# Altium schematic sheet Power.SchDoc
size Letter
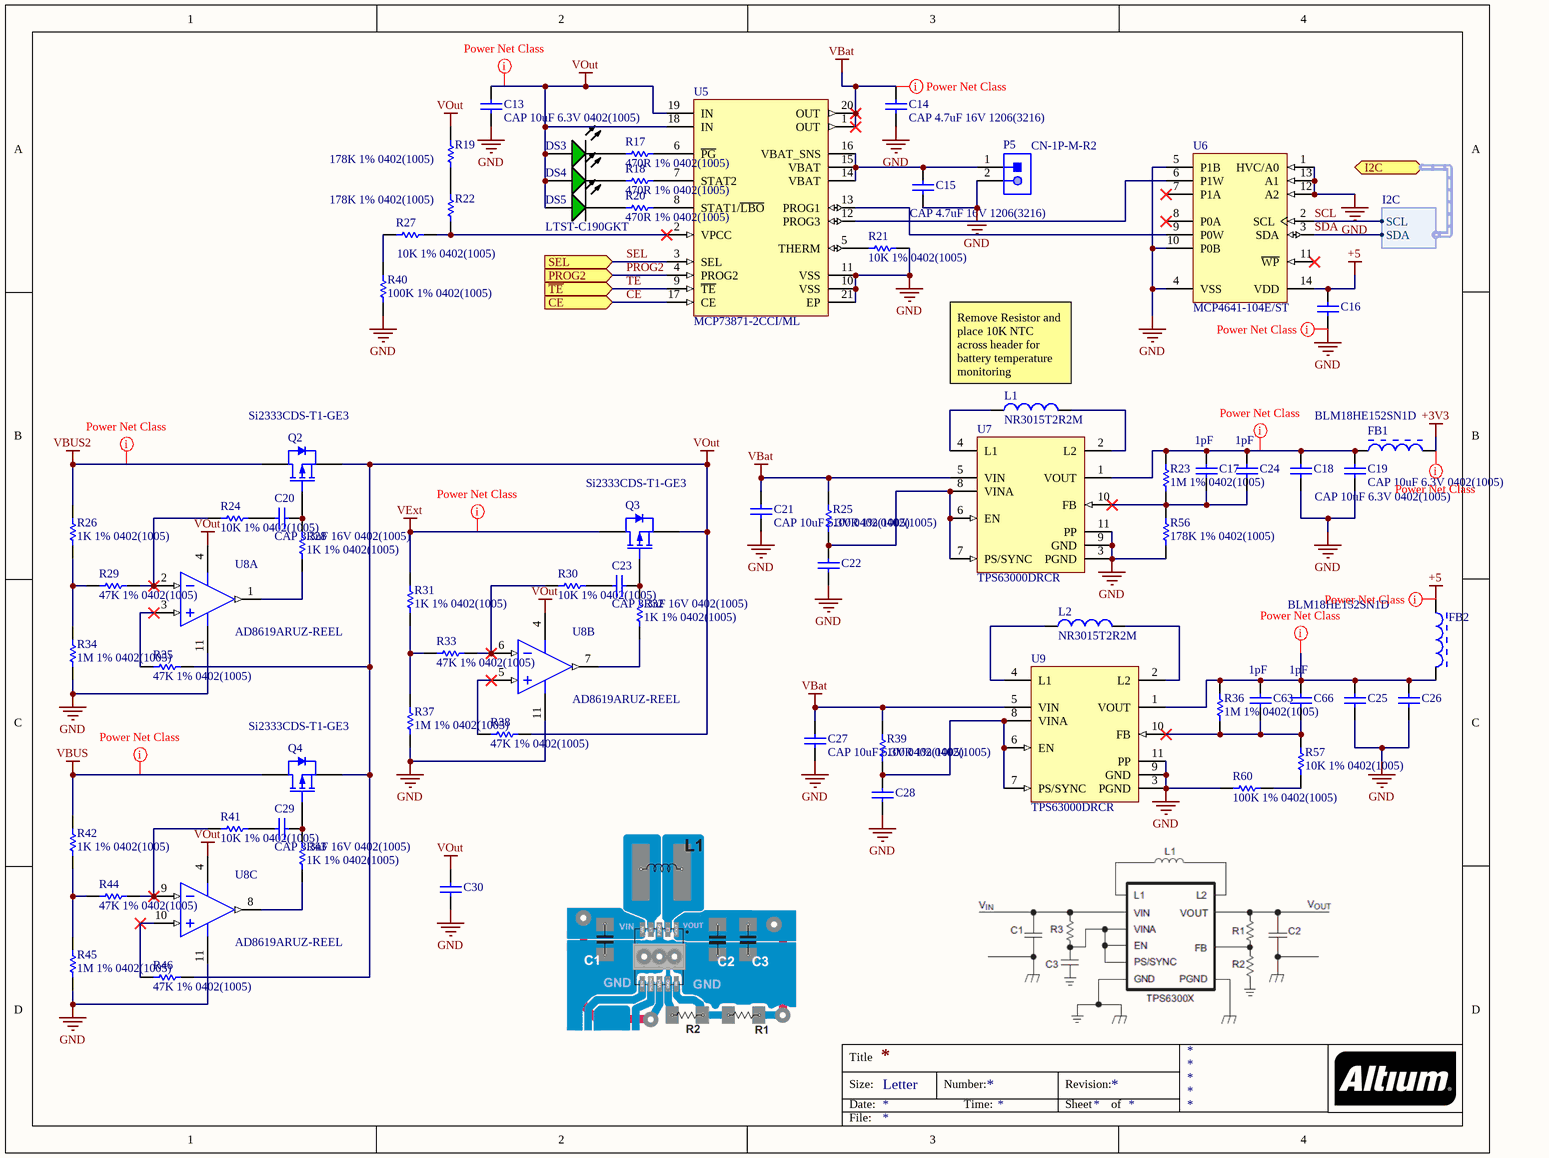
[diagram p0: Power.SchDoc]

## Parts
(Parts that share a designator on the sheet are numbered #1, #2 ... from top to bottom, then left to right.)
C13  CAP 10uF 6.3V 0402(1005)  [CAPC0402(1005)60_L]
C14  CAP 4.7uF 16V 1206(3216)  [CAPC1206(3216)190_N]
C15  CAP 4.7uF 16V 1206(3216)  [CAPC1206(3216)190_N]
C16  CAP 100nF 10V 0402(1005)  [CAPC0402(1005)60_L]  (value not drawn)
C17  value 1pF  [CAPC0402(1005)33_L]  (hidden comment: CAP 1pF 50V 0402(1005))
C18  CAP 10uF 6.3V 0402(1005)  [CAPC0402(1005)60_L]
C19  CAP 10uF 6.3V 0402(1005)  [CAPC0402(1005)60_L]
C20  CAP 3.3nF 16V 0402(1005)  [CAPC0402(1005)60_L]
C21  CAP 10uF 6.3V 0402(1005)  [CAPC0402(1005)60_L]
C22  CAP 100nF 10V 0402(1005)  [CAPC0402(1005)60_L]  (value not drawn)
C23  CAP 3.3nF 16V 0402(1005)  [CAPC0402(1005)60_L]
C24  value 1pF  [CAPC0402(1005)33_L]  (hidden comment: CAP 1pF 50V 0402(1005))
C25  CAP 10uF 6.3V 0402(1005)  [CAPC0402(1005)60_L]  (value not drawn)
C26  CAP 10uF 6.3V 0402(1005)  [CAPC0402(1005)60_L]  (value not drawn)
C27  CAP 10uF 6.3V 0402(1005)  [CAPC0402(1005)60_L]
C28  CAP 100nF 10V 0402(1005)  [CAPC0402(1005)60_L]  (value not drawn)
C29  CAP 3.3nF 16V 0402(1005)  [CAPC0402(1005)60_L]
C30  CAP 100nF 10V 0402(1005)  [CAPC0402(1005)60_L]  (value not drawn)
C63  value 1pF  [CAPC0402(1005)33_L]  (hidden comment: CAP 1pF 50V 0402(1005))
C66  value 1pF  [CAPC0402(1005)33_L]  (hidden comment: CAP 1pF 50V 0402(1005))
DS3  LTST-C190GKT  [LTST-C190GKT_V]  (value not drawn)
DS4  LTST-C190GKT  [LTST-C190GKT_V]  (value not drawn)
DS5  LTST-C190GKT  [LTST-C190GKT_V]
FB1  BLM18HE152SN1D  [MURA-BLM18-RF-H4-CHIP-2_V]
FB2  BLM18HE152SN1D  [MURA-BLM18-RF-H4-CHIP-2_V]
L1  NR3015T2R2M  [TAYO-IND0315_V]
L2  NR3015T2R2M  [TAYO-IND0315_V]
P5  CN-1P-M-R2  [B2B-PH-K-S]
Q2  Si2333CDS-T1-GE3  [DIOD-SOT23-3_V]
Q3  Si2333CDS-T1-GE3  [DIOD-SOT23-3_V]
Q4  Si2333CDS-T1-GE3  [DIOD-SOT23-3_V]
R17  470R 1% 0402(1005)  [RESC0402(1005)_L]
R18  470R 1% 0402(1005)  [RESC0402(1005)_L]
R19  178K 1% 0402(1005)  [RESC0402(1005)_L]
R20  470R 1% 0402(1005)  [RESC0402(1005)_L]
R21  10K 1% 0402(1005)  [RESC0402(1005)_L]
R22  178K 1% 0402(1005)  [RESC0402(1005)_L]
R23  1M 1% 0402(1005)  [RESC0402(1005)_L]
R24  10K 1% 0402(1005)  [RESC0402(1005)_L]
R25  100R 1% 0402(1005)  [RESC0402(1005)_L]
R26  1K 1% 0402(1005)  [RESC0402(1005)_L]
R27  10K 1% 0402(1005)  [RESC0402(1005)_L]
R28  1K 1% 0402(1005)  [RESC0402(1005)_L]
R29  47K 1% 0402(1005)  [RESC0402(1005)_L]
R30  10K 1% 0402(1005)  [RESC0402(1005)_L]
R31  1K 1% 0402(1005)  [RESC0402(1005)_L]
R32  1K 1% 0402(1005)  [RESC0402(1005)_L]
R33  47K 1% 0402(1005)  [RESC0402(1005)_L]
R34  1M 1% 0402(1005)  [RESC0402(1005)_L]
R35  47K 1% 0402(1005)  [RESC0402(1005)_L]
R36  1M 1% 0402(1005)  [RESC0402(1005)_L]
R37  1M 1% 0402(1005)  [RESC0402(1005)_L]
R38  47K 1% 0402(1005)  [RESC0402(1005)_L]
R39  100R 1% 0402(1005)  [RESC0402(1005)_L]
R40  100K 1% 0402(1005)  [RESC0402(1005)_L]
R41  10K 1% 0402(1005)  [RESC0402(1005)_L]
R42  1K 1% 0402(1005)  [RESC0402(1005)_L]
R43  1K 1% 0402(1005)  [RESC0402(1005)_L]
R44  47K 1% 0402(1005)  [RESC0402(1005)_L]
R45  1M 1% 0402(1005)  [RESC0402(1005)_L]
R46  47K 1% 0402(1005)  [RESC0402(1005)_L]
R56  178K 1% 0402(1005)  [RESC0402(1005)_L]
R57  10K 1% 0402(1005)  [RESC0402(1005)_L]
R60  100K 1% 0402(1005)  [RESC0402(1005)_L]
U5  MCP73871-2CCI/ML  [QFN-ML20_M]
U6  MCP4641-104E/ST  [TSSOP-ST14_L]
U7  TPS63000DRCR  [DRC0010J_V]
U8#1  AD8619ARUZ-REEL  [ADI-RU-14_N]  (part A of 4)
U8#2  AD8619ARUZ-REEL  [ADI-RU-14_N]  (parts B,C of 4)
U9  TPS63000DRCR  [DRC0010J_V]

## Ports
CE (in), I2C (harness I2C), PROG2 (in), SEL (in), ~{TE} (in)

## Harnesses
I2C: SCL, SDA

## Nets
+3V3: FB1.2
+5: C16.2 FB2.1 U6.14(VDD)
GND: C13.1 C14.2 C15.1 C16.1 C18.1 C19.1 C21.1 C22.1 C25.1 C26.1 C27.1 C28.1 C30.1 P5.2 R21.2 R34.1 R37.1 R40.2 R45.1 R56.1 R60.1 U5.10(VSS) U5.11(VSS) U5.21(EP) U6.1(HVC/A0) U6.4(VSS) U6.5(P1B) U6.10(P0B) U6.12(A2) U6.13(A1) U7.3(PGND) U7.9(GND) U7.11(PP) U8#1.11(-V) U8#2.11(-V) U9.3(PGND) U9.9(GND) U9.11(PP)
VBat: C14.1 C21.2 C27.2 R25.2 R39.2 U5.1(OUT) U5.20(OUT) U7.5(VIN) U9.5(VIN)
VBUS: Q4.3(D) R42.2
VBUS2: Q2.3(D) R26.2
VExt: Q3.3(D) R31.2
VOut: C13.2 C30.2 DS3.1(A) DS4.1(A) DS5.1(A) Q2.2(S) Q3.2(S) Q4.2(S) R19.1 R35.2 R38.2 R46.2 U5.18(IN) U5.19(IN) U8#1.4(+V) U8#2.4(+V)
CE: U5.17(CE) ; port CE
PROG2: U5.4(PROG2) ; port PROG2
SCL: U6.2(SCL) ; port I2C.SCL
SDA: U6.3(SDA) ; port I2C.SDA
SEL: U5.3(SEL) ; port SEL
~{TE}: U5.9(~{TE}) ; port ~{TE}
NetC15_2: C15.2 P5.1 U5.14(VBAT) U5.15(VBAT) U5.16(VBAT_SNS)
NetC17_1: C17.1 C24.1 R23.1 R56.2 U7.10(FB)
NetC17_2: C17.2 C18.2 C19.2 C24.2 FB1.1 R23.2 U7.1(VOUT)
NetC20_1: C20.1 Q2.1(G) R28.2
NetC20_2: C20.2 R24.2
NetC22_2: C22.2 R25.1 U7.6(EN) U7.7(PS/SYNC) U7.8(VINA)
NetC23_1: C23.1 Q3.1(G) R32.2
NetC23_2: C23.2 R30.2
NetC25_2: C25.2 C26.2 C63.2 C66.2 FB2.2 R36.2 U9.1(VOUT)
NetC28_2: C28.2 R39.1 U9.6(EN) U9.7(PS/SYNC) U9.8(VINA)
NetC29_1: C29.1 Q4.1(G) R43.2
NetC29_2: C29.2 R41.2
NetC63_1: C63.1 C66.1 R36.1 R57.2 U9.10(FB)
NetDS3_2: DS3.2(K) R17.1
NetDS4_2: DS4.2(K) R18.1
NetDS5_2: DS5.2(K) R20.1
NetL1_1: L1.1 U7.4(L1)
NetL1_2: L1.2 U7.2(L2)
NetL2_1: L2.1 U9.4(L1)
NetL2_2: L2.2 U9.2(L2)
NetR17_2: R17.2 U5.6(~{PG})
NetR18_2: R18.2 U5.7(STAT2)
NetR19_2: R19.2 R22.1
NetR20_2: R20.2 U5.8(STAT1/~{LBO})
NetR21_1: R21.1 U5.5(THERM)
NetR22_2: R22.2 R27.2 U5.2(VPCC)
NetR24_1: R24.1 R29.2 U8#1.2(-IN_A)
NetR26_1: R26.1 R29.1 R34.2
NetR27_1: R27.1 R40.1
NetR28_1: R28.1 U8#1.1(OUT_A)
NetR30_1: R30.1 R33.2 U8#2.6(-IN_B)
NetR31_1: R31.1 R33.1 R37.2
NetR32_1: R32.1 U8#2.7(OUT_B)
NetR35_1: R35.1 U8#1.3(+IN_A)
NetR38_1: R38.1 U8#2.5(+IN_B)
NetR41_1: R41.1 R44.2 U8#2.9(-IN_C)
NetR42_1: R42.1 R44.1 R45.2
NetR43_1: R43.1 U8#2.8(OUT_C)
NetR46_1: R46.1 U8#2.10(+IN_C)
NetR57_1: R57.1 R60.2
NetU5_12: U5.12(PROG3) U6.6(P1W)
NetU5_13: U5.13(PROG1) U6.9(P0W)

Not connected (* = marked no-connect by the designer): U6 7(P1A)* 8(P0A)* 11(~{WP})*

## Layout directives
net class PowerNets: +3V3, +5, GND, NetC17_2, NetC25_2, VBat, VBUS, VBUS2, VExt, VOut

## Notes on the sheet
- (near L1) Remove Resistor and place 10K NTC across header for battery temperature monitoring
- Title
- Size:
- Date:
- Letter
- Number:
- Time:
- Revision:
- Sheet
- of
- File:

## Library data of the parts
C13 = CMP-1034-02138-1: CAP 10uF 6.3V ±20% 0402 (1005 Metric) Thickness 0.6mm SMD; Case-Metric: 1005; Tolerance: Â±20%; Case-EIA: 0402; Rated Voltage: 6.3 V; Value: 10uF; Technology: SMT; Max Thickness: 0.6 mm
C14 C15 = CMP-1037-04912-1: CAP 4.7uF 16V ±20% 1206 (3216 Metric) Thickness 1.9mm SMD; Tolerance: Â±20%; Case-EIA: 1206; Case-Metric: 3216; Max Thickness: 1.9 mm; Technology: SMT; Rated Voltage: 16 V; Value: 4.7uF
C16 C22 C28 C30 = CMP-1034-02066-1: CAP 100nF 10V ±20% 0402 (1005 Metric) Thickness 0.6mm SMD; Tolerance: Â±20%; Case-Metric: 1005; Case-EIA: 0402; Max Thickness: 0.6 mm; Rated Voltage: 10 V; Technology: SMT; Value: 100nF
C17 C24 C63 C66 = CMP-1034-00058-1: CAP 1pF 50V ±0.25pF 0402 (1005 Metric) Thickness 0.33mm SMD; Case-Metric: 1005; Case-EIA: 0402; Tolerance: Â±0.25pF; Technology: SMT; Max Thickness: 0.33 mm; Rated Voltage: 50 V
C18 C19 C21 C25-C27 = CMP-1034-02138-1: CAP 10uF 6.3V ±20% 0402 (1005 Metric) Thickness 0.6mm SMD; Tolerance: Â±20%; Case-EIA: 0402; Case-Metric: 1005; Max Thickness: 0.6 mm; Rated Voltage: 6.3 V; Technology: SMT; Value: 10uF
C20 C23 C29 = CMP-1034-01771-1: CAP 3.3nF 16V ±5% 0402 (1005 Metric) Thickness 0.6mm SMD; Case-EIA: 0402; Case-Metric: 1005; Tolerance: Â±5%; Value: 3.3nF; Technology: SMT; Rated Voltage: 16 V; Max Thickness: 0.6 mm
DS3-DS5 = CMP-1674-00007-1: LED Uni-Color Green, 100 mW, 5 V, -55 to 85 degC, 2-Pin SMD, RoHS, Tape and Reel; ComponentLink2Description: Datasheet; ComponentLink2URL: http://datasheet.octopart.com/LTST-C190GKT-Lite-On-datasheet-158530.pdf; ComponentLink1Description: Manufacturer URL; PackageReference: C190GKT; PackageDescription: 2-Pin Surface Mount Device, Body 1.6 x 0.8 mm; ComponentLink1URL: http://www.us.liteon.com/; DatasheetVersion: Dec-06
FB1 FB2 = CMP-0686-00368-2: Chip Ferrite Bead for GHz Band High-speed Signal Lines, 1500 Ohm, 500 mA, -55 to 125 degC, 1.6 x 0.8 x 0.95 mm SMD, Tape and Reel; Manufacturer: Murata; Rated Current: 500 mA; Impedance (at 100 MHz): 1500 Ohm +/- 25%; DC Resistance: 0.50 Ohm Max.; Packing: Tape and Reel; DatasheetVersion: 08/2013; ComponentLink1URL: http://www.murata.com/; Mounting Technology: Surface Mount; ComponentLink2URL: http://www.murata.com/products/catalog/pdf/c31e.pdf; ComponentLink3Description: Package Specification; ComponentLink2Description: Datasheet; PackageReference: BLM18_H950-2; ComponentLink1Description: Manufacturer URL; PackageDescription: 2-Pin Chip, Body 1.6 x 0.8 mm; ComponentLink3URL: http://www.murata.com/products/catalog/pdf/c31e.pdf; PartNumber: BLM18HE152SN1D; Operating Temperature Range: -55 to 125 degC
L1 L2 = CMP-0569-00001-2: SMD Power Inductor, 2.2 uH, +/- 20%, 3 x 3 x 1.5 mm, -25 to 120 degC, Pb-Free, Tape and Reel; Manufacturer: Taiyo Yuden; Inductance: 2.2 uH (+/-20%); Rated Current-Temperature Rise Current: 1500 mA; DC Resistance (max): 0.072 Ohm; Rated Current-Saturation Current: 1480 mA; Inductance Measuring Frequency: 100 kHz; Self-Resonant Frequency (min): 64 MHz; Avg. of DC. Resistance: 0.06 Ohm; Soldering Method: Reflow; Temperature Range: -25 to 120 degC; ComponentLink1Description: Manufacturer URL; Mounting Technology: Surface Mount; Halogen Free: TRUE; ComponentLink1URL: www.yuden.co.jp; Packing: Tape and Reel; DatasheetVersion: 1/11/2013; PackageDescription: 2-Pin SMT Inductor, Body 3 x 3 mm; ComponentLink2URL: http://www.yuden.co.jp/ut/product/category/inductor/NR3015T2R2M.pdf; PartNumber: NR3015T2R2M; RoHS Compliance: TRUE; PackageReference: IND3015; ComponentLink2Description: Datasheet; Case Size: 3015
Q2-Q4 = CMP-00020-0000-A.2: MOSFET 12V 5.1A 2.5W 35 mohms @ 4.5V; Manufacturer: Vishay; Channel Mode: Enhancement; Brand: Vishay Semiconductors; Rise Time: 35 ns; Transistor Polarity: P-Channel; Vgs - Gate-Source Voltage: 8 V; Number of Channels: 1 Channel; Pd - Power Dissipation: 1.25 W; Configuration: Single; Typical Turn-Off Delay Time: 45 ns; Transistor Type: 1 P-Channel; Vds - Drain-Source Breakdown Voltage: - 12 V; Typical Turn-On Delay Time: 13 ns; Tradename: TrenchFET; Standard Pack Qty: 3000; Reeling: True; Supplier Part Number: 781-SI2333CDS-T1-GE3; Series: SI2; Length: 3.04 mm; ComponentLink1URL: http://www.mouser.com/ds/2/427/si2333cd-244460.pdf; RoHS - Mouser: Y; Technology: Si; Width: 1.4 mm; Maximum Operating Temperature: + 150 C; Rds On - Drain-Source Resistance: 35 mOhms; Product: MOSFET Small Signal; Manufacturer Part Number: Si2333CDS-T1-GE3; Minimum Operating Temperature: - 55 C; Minimum Order Quantity: 1; Height: 1.02 mm; Supplier: Mouser; ComponentLink1Description: si2333cd-244460.pdf; Id - Continuous Drain Current: 5.1 A; Fall Time: 35 ns; Mounting Style: SMD/SMT; Package / Case: SOT-23-3; Packaging: Reel
R17 R18 R20 = CMP-1011-00473-1: 470R 0.063W 1% 0402 (1005 Metric)  SMD; Case-Metric: 1005; Case-EIA: 0402; Value: 470.00 Ohm; Tolerance: 1 %; Technology: SMT; Power: 0.063 W
R19 R22 R56 = CMP-1011-00762-1: 178K 0.063W 1% 0402 (1005 Metric)  SMD; Case-Metric: 1005; Case-EIA: 0402; Value: 178000.00 Ohm; Technology: SMT; Power: 0.063 W; Tolerance: 1 %
R21 = CMP-1011-00623-1: 10K 0.063W 1% 0402 (1005 Metric)  SMD; Case-EIA: 0402; Value: 10000.00 Ohm; Case-Metric: 1005; Technology: SMT; Tolerance: 1 %; Power: 0.063 W
R23 R34 R36 R37 R45 = CMP-1011-00849-1: 1M 0.063W 1% 0402 (1005 Metric)  SMD; Value: 1000000.00 Ohm; Case-EIA: 0402; Case-Metric: 1005; Power: 0.063 W; Tolerance: 1 %; Technology: SMT
R24 R27 R30 R41 R57 = CMP-1011-00623-1: 10K 0.063W 1% 0402 (1005 Metric)  SMD; Value: 10000.00 Ohm; Case-EIA: 0402; Case-Metric: 1005; Power: 0.063 W; Tolerance: 1 %; Technology: SMT
R25 R39 = CMP-1011-00397-1: 100R 0.063W 1% 0402 (1005 Metric)  SMD; Case-EIA: 0402; Value: 100.00 Ohm; Case-Metric: 1005; Tolerance: 1 %; Technology: SMT; Power: 0.063 W
R26 R28 R31 R32 R42 R43 = CMP-1011-00510-1: 1K 0.063W 1% 0402 (1005 Metric)  SMD; Case-Metric: 1005; Case-EIA: 0402; Value: 1000.00 Ohm; Technology: SMT; Tolerance: 1 %; Power: 0.063 W
R29 R33 R35 R38 R44 R46 = CMP-1011-00699-1: 47K 0.063W 1% 0402 (1005 Metric)  SMD; Case-Metric: 1005; Case-EIA: 0402; Value: 47000.00 Ohm; Technology: SMT; Power: 0.063 W; Tolerance: 1 %
R40 R60 = CMP-1011-00736-1: 100K 0.063W 1% 0402 (1005 Metric)  SMD; Value: 100000.00 Ohm; Case-Metric: 1005; Case-EIA: 0402; Power: 0.063 W; Tolerance: 1 %; Technology: SMT
U5 = CMP-0133-00005-1: Stand-Alone System Load Sharing and Li-Ion/Li-Polymer Battery Charge Management Controller, 4.2V, 20-Pin QFN, Industrial Temperature; PackageDescription: 20-Lead Plastic Quad Flat, No Lead Package (ML) - 4x4x0.9 mm Body [QFN]; PackageReference: QFN-ML20; PackageVersion: revBB, Aug-2009; DatasheetVersion: revB, May-2009
U6 = CMP-0188-00813-2: 7-Bit Dual I2C Digital POT with Non-Volatile Memory, 14-pin TSSOP, Extended Temperature; ComponentLink1URL: http://www.microchip.com/; ComponentLink3Description: Package Specification; PackageDescription: 14-Lead Plastic Thin Shrink Small Outline (ST) - 4.4mm Body [TSSOP]; ComponentLink2URL: http://ww1.microchip.com/downloads/en/DeviceDoc/22107a.pdf; DatasheetVersion: revA, Nov-2008; ComponentLink2Description: Datasheet; ComponentLink3URL: http://www.microchip.com/stellent/groups/techpub_sg/documents/packagingspec/en012702.pdf; ComponentLink1Description: Manufacturer URL; RevisionNote: URLs added.; PackageVersion: revBB, Aug-2009; PackageReference: TSSOP-ST14
U7 U9 = CMP-0345-00001-2: Buck-Boost Voltage Converter with 1.8 to 5.5 V Input and 1.2 to 5.5 V Output, -40 to 85 degC, 10-Pin SON (DRC), Green (RoHS & no Sb/Br); Manufacturer: Texas Instruments; Vout(Max)(V): 5.5; Synchronous Rectification: TRUE; SubFamily: Buck-Boost Regulator; Vin(Min)(V): 1.8; Iq(Typ)(mA): 0.04; Iout(Max)(A): 1.2; Regulated Outputs(#): 1; Switching Frequency(Max)(kHz): 1500; ComponentLink1Description: Datasheet; Mounting Technology: Surface Mount; DatasheetVersion: SLVS520B; Eco-Plan: Green (RoHS & no Sb/Br); PackageVersion: revL, Sep-2011; PackageDescription: 10-Pin Plastic Small Outline No-Lead, 3 x 3 x 1 mm Body, 0.5 mm Pitch, Exposed Pad; Vout(Min)(V): 1.2; Vin(Max)(V): 5.5; Topology: Buck-Boost; Dynamic Voltage Scaling: TRUE; ComponentLink1URL: http://www.ti.com/general/docs/lit/getliterature.tsp?genericPartNumber=TPS63000&fileType=pdf; PartNumber: TPS63000DRCR; ComponentLink2URL: http://www.ti.com/litv/pdf/mpds117k; PackageReference: DRC0010J; ComponentLink2Description: Package Specification
U8#1 U8#2 = CMP-0384-01896-1: Quad Channel Single-Supply Operation Operational Amplifier, 400 KHz BW, 100 mV/us SR, Industrial, 14-pin SOP (RU-14), Reel; Generic Part Number: AD8619; Manufacturer: Analog Devices; Iq/Amp: 38uA; V Span Max: 5V; V Span Min: 1.8V; Input Bias Current: 200fA; Amplifiers Per Package: 4; Input Offset Voltage: 400uV; Small Signal Bandwidth: 400KHz; ComponentLink2Description: Datasheet; Mounting Technology: Surface Mount; PackageDescription: 14-Pin Thin Shrink Small Outline Package, Body 5 x 4.4 mm, Pitch 0.65 mm; DatasheetVersion: Rev. E; Code_JEDEC: MO-153AB-1; ComponentLink2URL: http://www.analog.com/static/imported-files/data_sheets/AD8613_8617_8619.pdf; ComponentLink3URL: http://www.analog.com/static/imported-files/packages/36057385283879153717235186773RU14.pdf; ComponentLink1Description: Manufacturer URL; ComponentLink3Description: Package Specification; Slew Rate: 100mV/us; ComponentLink1URL: http://www.analog.com/en/index.html; PartNumber: AD8619ARUZ-REEL; PackageReference: RU-14; PartId: 1